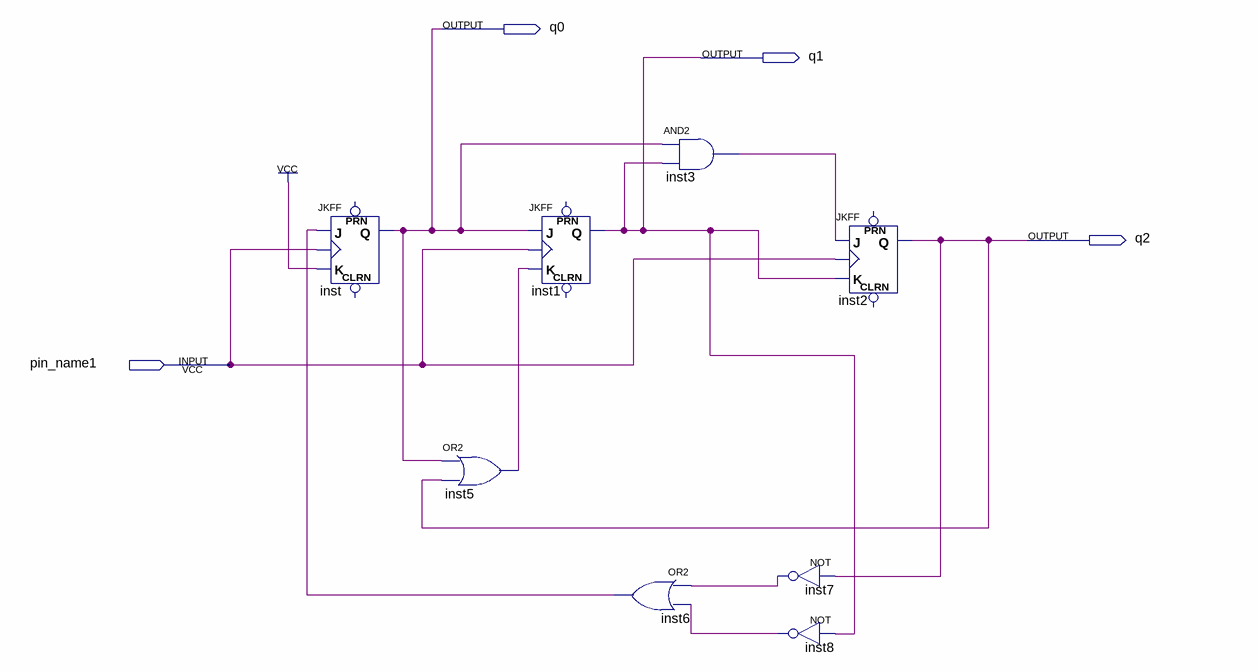
[diagram p0: schematic sheet]
// Quartus schematic numarator7.bdf as structural Verilog: 8 symbols, 4 pins
module numarator7 (
  input  pin_name1,
  output q0,
  output q1,
  output q2
);

  wire inst3_out, inst5_out, inst6_out, inst7_out, inst8_out;

  JKFF inst (.K(1'b1), .J(inst6_out), .CLK(pin_name1), .Q(q0));  // open: PRN, CLRN
  or inst5 (inst5_out, q0, q2);
  JKFF inst1 (.K(inst5_out), .J(q0), .CLK(pin_name1), .Q(q1));  // open: PRN, CLRN
  or inst6 (inst6_out, inst7_out, inst8_out);
  and inst3 (inst3_out, q0, q1);
  not inst7 (inst7_out, q2);
  not inst8 (inst8_out, q1);
  JKFF inst2 (.K(q1), .J(inst3_out), .CLK(pin_name1), .Q(q2));  // open: PRN, CLRN
endmodule
